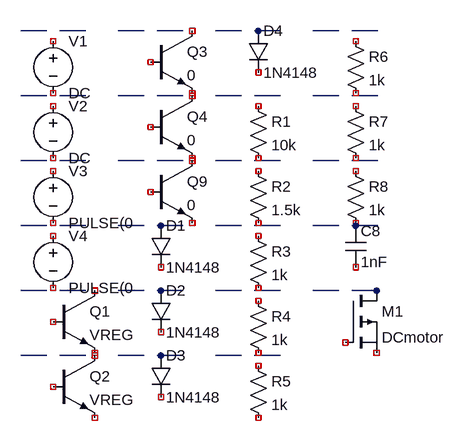
[diagram p0: schematic output.asc]
output.asc, the LTspice schematic file:
Version 4
SHEET 1 1020 740
SYMBOL voltage 100 100 R0
SYMATTR InstName V1
SYMATTR Value DC
WIRE 110 100 150 100
WIRE 90 100 50 100
SYMBOL voltage 100 200 R0
SYMATTR InstName V2
SYMATTR Value DC
WIRE 110 200 150 200
WIRE 90 200 50 200
SYMBOL voltage 100 300 R0
SYMATTR InstName V3
SYMATTR Value PULSE(0
WIRE 110 300 150 300
WIRE 90 300 50 300
SYMBOL voltage 100 400 R0
SYMATTR InstName V4
SYMATTR Value PULSE(0
WIRE 110 400 150 400
WIRE 90 400 50 400
SYMBOL npn 100 500 R0
SYMATTR InstName Q1
SYMATTR Value VREG
WIRE 110 500 150 500
WIRE 90 500 50 500
SYMBOL npn 100 600 R0
SYMATTR InstName Q2
SYMATTR Value VREG
WIRE 110 600 150 600
WIRE 90 600 50 600
SYMBOL npn 250 100 R0
SYMATTR InstName Q3
SYMATTR Value 0
WIRE 260 100 300 100
WIRE 240 100 200 100
SYMBOL npn 250 200 R0
SYMATTR InstName Q4
SYMATTR Value 0
WIRE 260 200 300 200
WIRE 240 200 200 200
SYMBOL npn 250 300 R0
SYMATTR InstName Q9
SYMATTR Value 0
WIRE 260 300 300 300
WIRE 240 300 200 300
SYMBOL diode 250 400 R0
SYMATTR InstName D1
SYMATTR Value 1N4148
WIRE 260 400 300 400
WIRE 240 400 200 400
SYMBOL diode 250 500 R0
SYMATTR InstName D2
SYMATTR Value 1N4148
WIRE 260 500 300 500
WIRE 240 500 200 500
SYMBOL diode 250 600 R0
SYMATTR InstName D3
SYMATTR Value 1N4148
WIRE 260 600 300 600
WIRE 240 600 200 600
SYMBOL diode 400 100 R0
SYMATTR InstName D4
SYMATTR Value 1N4148
WIRE 410 100 450 100
WIRE 390 100 350 100
SYMBOL res 400 200 R0
SYMATTR InstName R1
SYMATTR Value 10k
WIRE 410 200 450 200
WIRE 390 200 350 200
SYMBOL res 400 300 R0
SYMATTR InstName R2
SYMATTR Value 1.5k
WIRE 410 300 450 300
WIRE 390 300 350 300
SYMBOL res 400 400 R0
SYMATTR InstName R3
SYMATTR Value 1k
WIRE 410 400 450 400
WIRE 390 400 350 400
SYMBOL res 400 500 R0
SYMATTR InstName R4
SYMATTR Value 1k
WIRE 410 500 450 500
WIRE 390 500 350 500
SYMBOL res 400 600 R0
SYMATTR InstName R5
SYMATTR Value 1k
WIRE 410 600 450 600
WIRE 390 600 350 600
SYMBOL res 550 100 R0
SYMATTR InstName R6
SYMATTR Value 1k
WIRE 560 100 600 100
WIRE 540 100 500 100
SYMBOL res 550 200 R0
SYMATTR InstName R7
SYMATTR Value 1k
WIRE 560 200 600 200
WIRE 540 200 500 200
SYMBOL res 550 300 R0
SYMATTR InstName R8
SYMATTR Value 1k
WIRE 560 300 600 300
WIRE 540 300 500 300
SYMBOL cap 550 400 R0
SYMATTR InstName C8
SYMATTR Value 1nF
WIRE 560 400 600 400
WIRE 540 400 500 400
SYMBOL pmos 550 500 R0
SYMATTR InstName M1
SYMATTR Value DCmotor
WIRE 560 500 600 500
WIRE 540 500 500 500
END

The netlist it stands for:
* output.asc
V1 NC_01 NC_02 DC
V2 NC_03 NC_04 DC
V3 NC_05 NC_06 PULSE(0
V4 NC_07 NC_08 PULSE(0
* Q1: VREG (symbol npn not certain, pin order unknown); nets seen at it: 0
* Q2: VREG (symbol npn not certain, pin order unknown); nets seen at it: 0
* Q3: 0 (symbol npn not certain, pin order unknown); nets seen at it: 0
* Q4: 0 (symbol npn not certain, pin order unknown); nets seen at it: 0
* Q9: 0 (symbol npn not certain, pin order unknown); nets seen at it: 0
D1 N019 NC_24 1N4148
D2 N021 NC_25 1N4148
D3 N023 NC_26 1N4148
D4 N025 NC_27 1N4148
R1 NC_28 NC_29 10k
R2 NC_30 NC_31 1.5k
R3 NC_32 NC_33 1k
R4 NC_34 NC_35 1k
R5 NC_36 NC_37 1k
R6 NC_38 NC_39 1k
R7 NC_40 NC_41 1k
R8 NC_42 NC_43 1k
C8 N043 NC_44 1nF
* M1: DCmotor (symbol pmos not certain, pin order unknown); nets seen at it: N045
.model D D
.lib standard.dio
.backanno
.end